# Altium schematic sheet LoRaBoard_3.SchDoc
size 410 x 297 mm; DocumentNumber: ABCD.000001.600.Э3; SheetNumber: 3; SheetTotal: 3; _DecimalNumber: ABCD.000001.600.Э3; _Sheet: 2; PageSetup: Record=PageOptions|CenterHorizontal=False|CenterVertical=False|PrintScale=1.00|XCorrection=1.00|YCorrection=1.00|PrintKind=0|BorderSize=5000000|LeftOffset=0|BottomOffset=0|Orientation=2|PaperLength=1000|PaperWidth=1000|Scale=100|PaperSource=7|PrintQuality=-3|MediaType=1|DitherType=10|PrintScaleMode=0|PaperKind=A3|PaperIndex=8
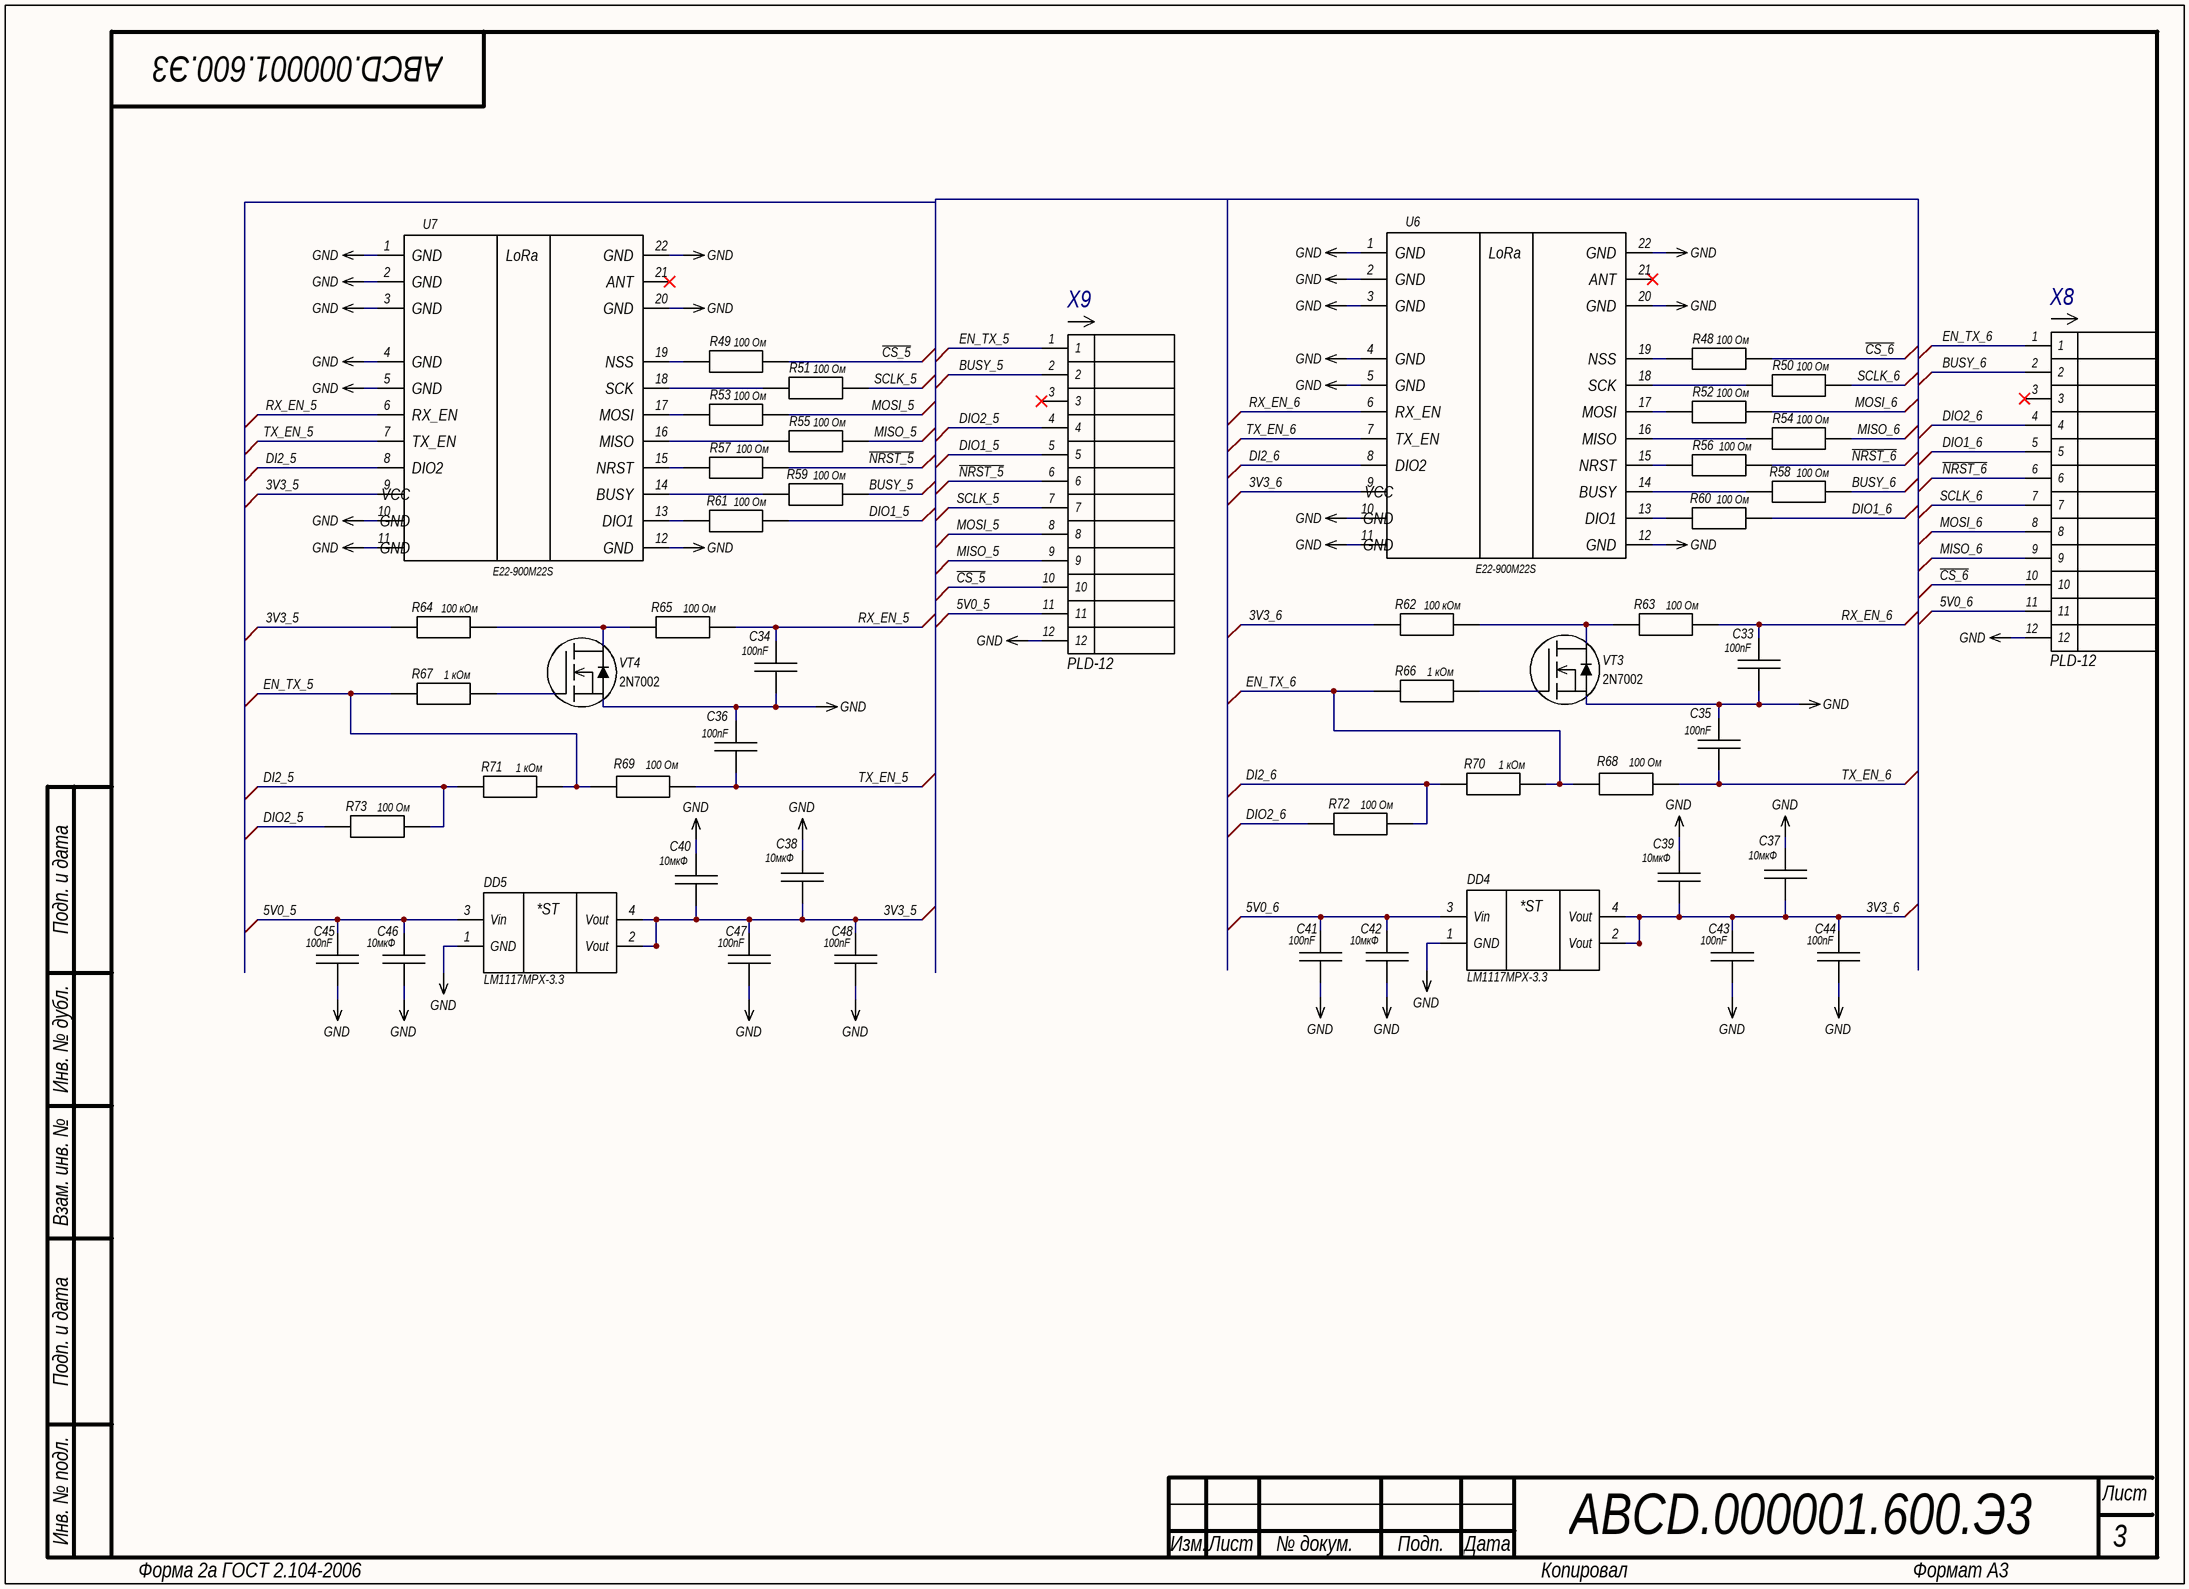
[diagram p0: LoRaBoard_3.SchDoc]

## Parts
C33  100nF  [CAP 0603_1608 RF]
C34  100nF  [CAP 0603_1608 RF]
C35  100nF  [CAP 0603_1608 RF]
C36  100nF  [CAP 0603_1608 RF]
C37  10мкФ  [CAP 0805]
C38  10мкФ  [CAP 0805]
C39  10мкФ  [CAP 0805]
C40  10мкФ  [CAP 0805]
C41  100nF  [CAP 0603_1608 RF]
C42  10мкФ  [CAP 0805]
C43  100nF  [CAP 0603_1608 RF]
C44  100nF  [CAP 0603_1608 RF]
C45  100nF  [CAP 0603_1608 RF]
C46  10мкФ  [CAP 0805]
C47  100nF  [CAP 0603_1608 RF]
C48  100nF  [CAP 0603_1608 RF]
DD4  LM1117MPX-3.3  [SOT223]
DD5  LM1117MPX-3.3  [SOT223]
R48  100 Ом  [RES 0603_1608]
R49  100 Ом  [RES 0603_1608]
R50  100 Ом  [RES 0603_1608]
R51  100 Ом  [RES 0603_1608]
R52  100 Ом  [RES 0603_1608]
R53  100 Ом  [RES 0603_1608]
R54  100 Ом  [RES 0603_1608]
R55  100 Ом  [RES 0603_1608]
R56  100 Ом  [RES 0603_1608]
R57  100 Ом  [RES 0603_1608]
R58  100 Ом  [RES 0603_1608]
R59  100 Ом  [RES 0603_1608]
R60  100 Ом  [RES 0603_1608]
R61  100 Ом  [RES 0603_1608]
R62  100 кОм  [RES 0603_1608]
R63  100 Ом  [RES 0603_1608]
R64  100 кОм  [RES 0603_1608]
R65  100 Ом  [RES 0603_1608]
R66  1 кОм  [RES 0603_1608]
R67  1 кОм  [RES 0603_1608]
R68  100 Ом  [RES 0603_1608]
R69  100 Ом  [RES 0603_1608]
R70  1 кОм  [RES 0603_1608]
R71  1 кОм  [RES 0603_1608]
R72  100 Ом  [RES 0603_1608]
R73  100 Ом  [RES 0603_1608]
U6  E22-900M22S  [E22 900M22S]
U7  E22-900M22S  [E22 900M22S]
VT3  2N7002  [SOT23-3]
VT4  2N7002  [SOT23-3]
X8  value PLD-12  [PLD_12_elipse]  (hidden comment: PLD-12 (DS1021-2x6))
X9  value PLD-12  [PLD_12_elipse]  (hidden comment: PLD-12 (DS1021-2x6))

## Nets
GND: C33.1 C34.1 C35.2 C36.2 C37.1 C38.1 C39.1 C40.1 C41.1 C42.1 C43.1 C44.1 C45.1 C46.1 C47.1 C48.1 DD4.1(GND) DD5.1(GND) U6.1 U6.2 U6.3 U6.4 U6.5 U6.10 U6.11 U6.12 U6.20 U6.22 U7.1 U7.2 U7.3 U7.4 U7.5 U7.10 U7.11 U7.12 U7.20 U7.22 VT3.2(S) VT4.2(S) X8.12 X9.12
3V3_5: C38.2 C40.2 C47.2 C48.2 DD5.2(Vout) DD5.4(Vout) R64.1 U7.9
3V3_6: C37.2 C39.2 C43.2 C44.2 DD4.2(Vout) DD4.4(Vout) R62.1 U6.9
5V0_5: C45.2 C46.2 DD5.3(Vin) X9.11
5V0_6: C41.2 C42.2 DD4.3(Vin) X8.11
BUSY_5: R59.2 X9.2
BUSY_6: R58.2 X8.2
~{CS_5}: R49.2 X9.10
~{CS_6}: R48.2 X8.10
DI2_5: R71.1 R73.2 U7.8
DI2_6: R70.1 R72.2 U6.8
DIO1_5: R61.2 X9.5
DIO1_6: R60.2 X8.5
DIO2_5: R73.1 X9.4
DIO2_6: R72.1 X8.4
EN_TX_5: R67.1 R69.1 R71.2 X9.1
EN_TX_6: R66.1 R68.1 R70.2 X8.1
MISO_5: R55.2 X9.9
MISO_6: R54.2 X8.9
MOSI_5: R53.2 X9.8
MOSI_6: R52.2 X8.8
~{NRST_5}: R57.2 X9.6
~{NRST_6}: R56.2 X8.6
RX_EN_5: C34.2 R65.2 U7.6
RX_EN_6: C33.2 R63.2 U6.6
SCLK_5: R51.2 X9.7
SCLK_6: R50.2 X8.7
TX_EN_5: C36.1 R69.2 U7.7
TX_EN_6: C35.1 R68.2 U6.7
NetR48_1: R48.1 U6.19
NetR49_1: R49.1 U7.19
NetR50_1: R50.1 U6.18
NetR51_1: R51.1 U7.18
NetR52_1: R52.1 U6.17
NetR53_1: R53.1 U7.17
NetR54_1: R54.1 U6.16
NetR55_1: R55.1 U7.16
NetR56_1: R56.1 U6.15
NetR57_1: R57.1 U7.15
NetR58_1: R58.1 U6.14
NetR59_1: R59.1 U7.14
NetR60_1: R60.1 U6.13
NetR61_1: R61.1 U7.13
NetR62_2: R62.2 R63.1 VT3.3(D)
NetR64_2: R64.2 R65.1 VT4.3(D)
NetR66_2: R66.2 VT3.1(G)
NetR67_2: R67.2 VT4.1(G)

Not connected (* = marked no-connect by the designer): U6 21*; U7 21*; X8 3*; X9 3*

## Notes on the sheet
- Подп. и дата
- Инв. № дубл.
- Взам. инв. №
- Инв. № подл.
- Изм.
- Лист
- № докум.
- Подп.
- Дата
- Форма 2а ГОСТ 2.104-2006
- Копировал
- Формат А3
- (in symbol E22-900M22S) GND; LoRa; ANT; NSS; SCK; RX_EN; MOSI; TX_EN; MISO; DIO2; NRST; VCC; BUSY; DIO1
- (in symbol LM1117MPX-3.3) *ST

## Library data of the parts
C33-C36 C41 C43-C45 C47 C48 = Capacitor: CC0603JPX7R9BB104, 50V 100nF X7R 5% 0603; Vendor Code: *; Value: 100nF; Part Number: CC0603JPX7R9BB104
C37-C40 C42 C46 = Capacitor: 10мкФ X5R 16В 10% 0805, CC0805KKX5R7BB106; Vendor Code: *; Value: 10мкФ; Part Number: CC0805KKX5R7BB106
DD4 DD5 = LM1117MPX-3.3: 800mA Low-Dropout Linear Regulator; Vendor Code: *; Value: LM1117MPX-3.3
R48-R61 R63 R65 R68 R69 R72 R73 = Resistor: 0.1Вт 0603 100 Ом, 5%, RC0603JR-07100RL; Type: Резистор; Vendor Code: *; Value: 100 Ом; Part Number: RC0603JR-07100RL
R62 R64 = Resistor: 0.1Вт 0603 100 кОм, 5%, RC0603JR-071KL; Part Number: RC0603JR-07100KL; Type: Резистор; Vendor Code: *; Value: 100 кОм
R66 R67 R70 R71 = Resistor: 0.1Вт 0603 1 кОм, 5%, RC0603JR-071KL; Type: Резистор; Vendor Code: *; Value: 1 кОм; Part Number: RC0603JR-071KL
U6 U7 = E22-900M22S: E22-900M22S Ebyte -147dBm 22.3dBm 7km SPI SMD,14x20mm LoRa Modules; Pitch: 1.27; Part Number: E22-900M22S; Value: E22-900M22S; Package: 14x20mm; Temperature Range: -40…+85 °C; Manufacturer: EBYTE; Number of Rows: 2; Number of Pins: 22
VT3 VT4 = 2N7002ET1G: MOSFET-N-60V-0.3A; Manufacturer: ON Semiconductor; Number of Channels: 1; Polarity: N-Channel; Drain Source Voltage: 60V; Drain Current: 0.3A; On Drain Source Resistance: 0.2Ohm; Gate Source Voltage: ±20V; Power Disspansion: 0.5W; Part Number: 2N7002ET1G; Value: 2N7002; Package: SOT-23; Temperature Range: -55…+150°C
X8 X9 = PLD-12: 2.54mm PIN Header 2X6P Straight Type H=2.5mm Full Gold Flash Plating.; Published: 07.03.2013; Publisher: Andrew Danich; Type: Вилка